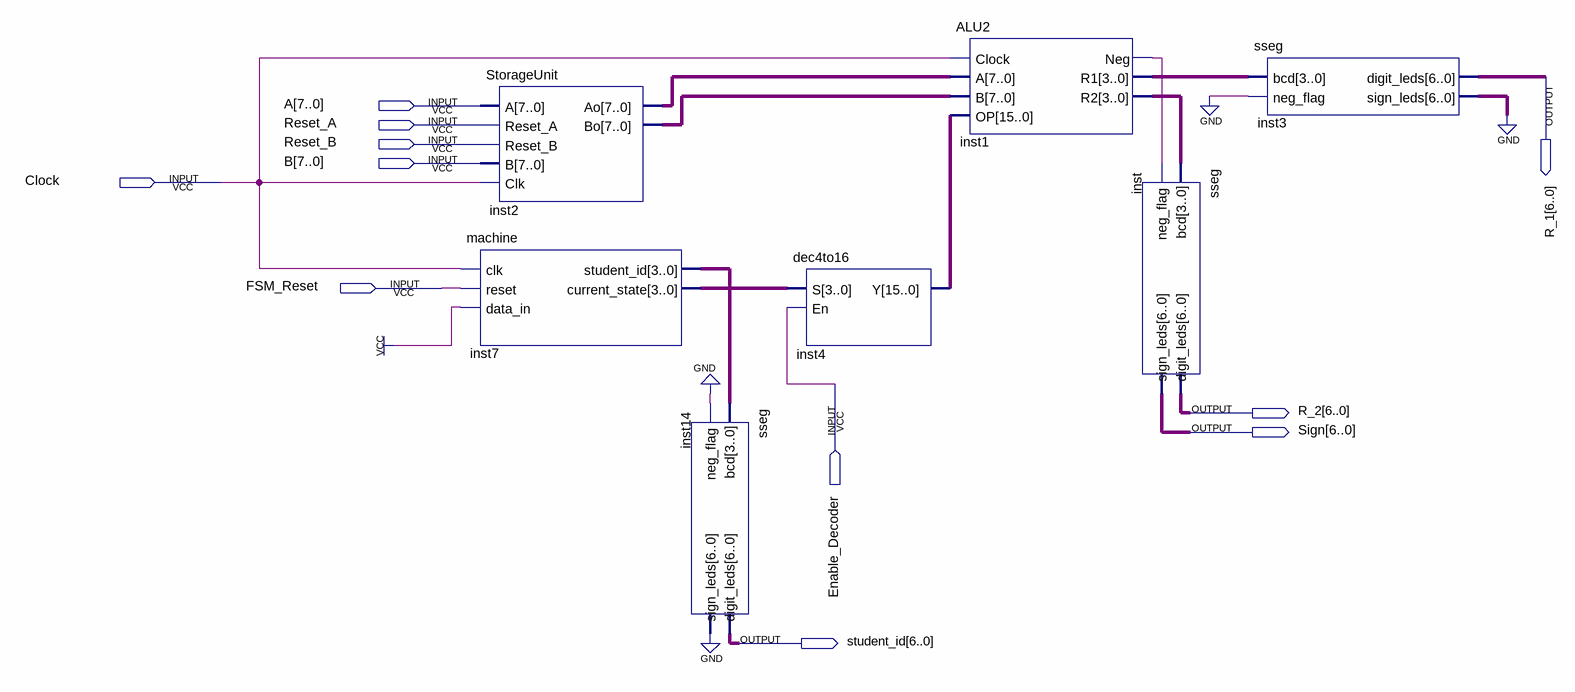
[diagram p0: schematic sheet]
// Quartus schematic lab6.bdf as structural Verilog: 7 symbols, 11 pins
module lab6 (
  input  [7:0] A,
  input  Reset_A,
  input  Reset_B,
  input  [7:0] B,
  input  Clock,
  input  FSM_Reset,
  input  Enable_Decoder,
  output [6:0] R_1,
  output [6:0] R_2,
  output [6:0] Sign,
  output [6:0] student_id
);

  wire inst1_neg;
  wire [3:0] inst1_r1, inst1_r2, inst7_current_state, inst7_student_id;
  wire [6:0] inst3_sign_leds, inst14_sign_leds;
  wire [7:0] inst2_ao, inst2_bo;
  wire [15:0] inst4_y;

  StorageUnit inst2 (.A(A), .Reset_A(Reset_A), .Reset_B(Reset_B), .B(B), .Clk(Clock), .Ao(inst2_ao), .Bo(inst2_bo));
  machine inst7 (
    .clk(Clock), .reset(FSM_Reset), .data_in(1'b1), .student_id(inst7_student_id),
    .current_state(inst7_current_state));
  sseg inst14 (.bcd(inst7_student_id), .neg_flag(1'b0), .digit_leds(student_id), .sign_leds(inst14_sign_leds));
  dec4to16 inst4 (.S(inst7_current_state), .En(Enable_Decoder), .Y(inst4_y));
  ALU2 inst1 (.Clock(Clock), .A(inst2_ao), .B(inst2_bo), .OP(inst4_y), .Neg(inst1_neg), .R1(inst1_r1), .R2(inst1_r2));
  sseg inst (.bcd(inst1_r2), .neg_flag(inst1_neg), .digit_leds(R_2), .sign_leds(Sign));
  sseg inst3 (.bcd(inst1_r1), .neg_flag(1'b0), .digit_leds(R_1), .sign_leds(inst3_sign_leds));
  // also tied to GND on the sheet: {inst3_sign_leds[0], inst3_sign_leds[1], inst3_sign_leds[2], inst3_sign_leds[3], inst3_sign_leds[4], inst3_sign_leds[5], inst3_sign_leds[6], inst14_sign_leds[0], inst14_sign_leds[1], inst14_sign_leds[2], inst14_sign_leds[3], inst14_sign_leds[4], inst14_sign_leds[5], inst14_sign_leds[6]}
endmodule
